# Altium schematic sheet Emulator_Schematic.SchDoc
size A
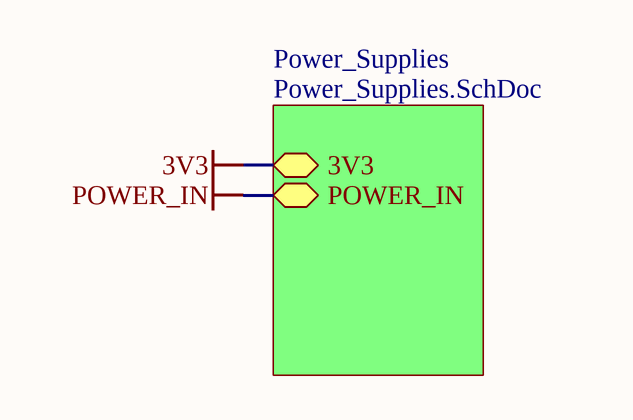
[diagram p0: Emulator_Schematic.SchDoc]

## Sub-sheets
Power_Supplies = Power_Supplies.SchDoc: 3V3, POWER_IN

## Nets
3V3: sheet Power_Supplies/3V3
POWER_IN: sheet Power_Supplies/POWER_IN